# Altium project team throttle control draft 2.PrjPcb
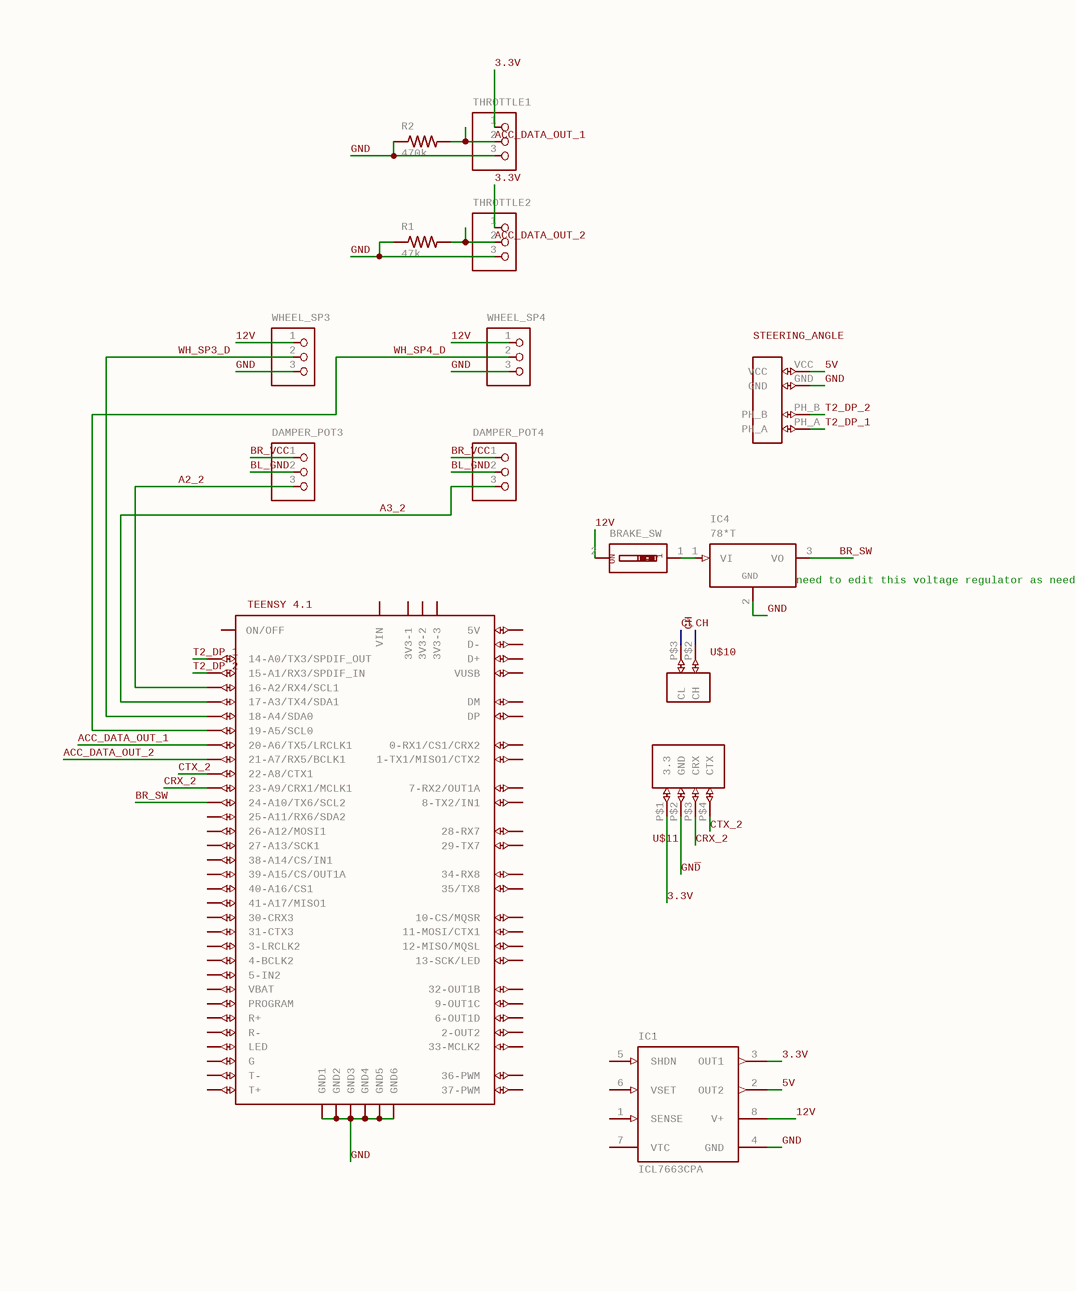
[diagram p0: team throttle control draft 2.SchDoc]
1 sheet, 15 parts. Net scope: global (net labels, ports and power ports of the same name join across sheets).
Board file: team throttle control draft 2.PcbDoc

## Sheet team throttle control draft 2.SchDoc
size 160 x 226 mm; Origin: Eagle

### Parts
BRAKE_SW  SW_DIP-1  [EDG-01]  (value not drawn)
DAMPER_POT3  PINHD-1X3CB  [1X03-CLEANBIG]  (value not drawn)
DAMPER_POT4  PINHD-1X3CB  [1X03-CLEANBIG]  (value not drawn)
IC1  ICL7663CPA  [DIL08]
IC4  78*T  [TO220H]
R1  47k  [0204/7]
R2  470k  [0204/7]
STEERING_ANGLE  ROTARY_ENCODER  [ROTARY_ENCODER]  (value not drawn)
THROTTLE1  PINHD-1X3  [1X03]  (value not drawn)
THROTTLE2  PINHD-1X3  [1X03]  (value not drawn)
U$3  TEENSY4.1: TEENSY 4.1  [TEENSY41]  (hidden comment: TEENSY41)
U$10  CAN_BUS  [CAN_BUS]  (value not drawn)
U$11  CAN_TEE  [CAN_TEN]  (value not drawn)
WHEEL_SP3  PINHD-1X3  [1X03]  (value not drawn)
WHEEL_SP4  PINHD-1X3  [1X03]  (value not drawn)

### Nets
3.3V: IC1.3(OUT1) THROTTLE1.1 THROTTLE2.1 U$11.P$1(3.3)
5V: IC1.2(OUT2) STEERING_ANGLE.VCC
12V: BRAKE_SW.2 IC1.8(V+) WHEEL_SP3.1 WHEEL_SP4.1
A2_2: DAMPER_POT3.3 U$3.16-A2/RX4/SCL1
A3_2: DAMPER_POT4.3 U$3.17-A3/TX4/SDA1
ACC_DATA_OUT_1: R2.2 THROTTLE1.2 U$3.20-A6/TX5/LRCLK1
ACC_DATA_OUT_2: R1.2 THROTTLE2.2 U$3.21-A7/RX5/BCLK1
BL_GND: DAMPER_POT3.2 DAMPER_POT4.2
BR_SW: IC4.3(VO) U$3.24-A10/TX6/SCL2
BR_VCC: DAMPER_POT3.1 DAMPER_POT4.1
CRX_2: U$3.23-A9/CRX1/MCLK1 U$11.P$3(CRX)
CTX_2: U$3.22-A8/CTX1 U$11.P$4(CTX)
GND: IC1.4(GND) IC4.2(GND) R1.1 R2.1 STEERING_ANGLE.GND THROTTLE1.3 THROTTLE2.3 U$3.GND1 U$3.GND2 U$3.GND3 U$3.GND4 U$3.GND5 U$3.GND6 WHEEL_SP3.3 WHEEL_SP4.3
GN~{D}: U$11.P$2(GND)
T2_DP_1: STEERING_ANGLE.PH_A U$3.14-A0/TX3/SPDIF_OUT
T2_DP_2: STEERING_ANGLE.PH_B U$3.15-A1/RX3/SPDIF_IN
WH_SP3_D: U$3.18-A4/SDA0 WHEEL_SP3.2
WH_SP4_D: U$3.19-A5/SCL0 WHEEL_SP4.2
NetBRAKE_SW_1: BRAKE_SW.1 IC4.1(VI)

Not connected (* = marked no-connect by the designer): IC1 1(SENSE) 5(SHDN) 6(VSET) 7(VTC); U$3 0-RX1/CS1/CRX2 1-TX1/MISO1/CTX2 2-OUT2 3-LRCLK2 3V3-1 3V3-2 3V3-3 4-BCLK2 5-IN2 6-OUT1D 7-RX2/OUT1A 8-TX2/IN2(8-TX2/IN1) 9-OUT1C 10-CS\MQSR(10-CS/MQSR) 11-MOSI/CTX1 12-MISO/MQSL 13-SCK/LED 25-A11/RX6/SDA2 26-A12/MOSI1 27-A13/SCK1 28-RX7 29-TX7 30-CRX3 31-CTX3 32-OUT1B 33-MCLK2 34-RX8 35-TX8(35/TX8) 36-PWM 37-PWM 38-A14/CS/IN1 39-A15/CS/OUT1A 40-A16/CS1 41-A17/MISO1 +5V(5V) D+ D- DM DP G LED ON/OFF PROGRAM R+ R- T+ T- VBAT VIN VUSB; U$10 P$2(CH) P$3(CL)

### Buses and harness runs
bus CH
bus CL

### Notes on the sheet
- (near IC4) need to edit this voltage regulator as needed

### Library data of the parts
BRAKE_SW = SW_DIP-1: DIP SWITCH; GateName_1: G$1; POPULARITY: 3; SymbolName_1: SW_DIP-1; LibraryName: special; DeviceSetName: SW_DIP-1; 1: 1; ON: ON
DAMPER_POT3 DAMPER_POT4 = PINHD-1X3CB: PIN HEADER; GateName_1: A; SymbolName_1: PINHD3; DeviceName: CB; LibraryName: adafruit; DeviceSetName: PINHD-1X3
IC1 = ICL7663CPA: Positive VOLTAGE REGULATOR; GateName_1: G$1; POPULARITY: 0; SymbolName_1: ICL7663; LibraryName: maxim; DeviceSetName: ICL7663CPA; MF: MF; MPN: MPN; OC_FARNELL: unknown; OC_NEWARK: unknown
IC4 = 78*T: Positive VOLTAGE REGULATOR   Added bigger pads to the TO-92 package; GateName_1: A1; SymbolName_1: 78XX; DeviceName: T; DeviceSetName: 78*; LibraryName: adafruit; GND: GND
R1 R2 = R-US_0204/7: RESISTOR, American symbol; GateName_1: G$1; SymbolName_1: R-US; DeviceSetName: R-US_; POPULARITY: 48; DeviceName: 0204/7; LibraryName: rcl; SPICEPREFIX: R
STEERING_ANGLE = ROTARY_ENCODER: GateName_1: G$1; SymbolName_1: ROTARY_ENCODER; LibraryName: F-E library custom components; DeviceSetName: ROTARY_ENCODER
THROTTLE1 THROTTLE2 WHEEL_SP3 WHEEL_SP4 = PINHD-1X3: PIN HEADER; GateName_1: A; SymbolName_1: PINHD3; LibraryName: adafruit; DeviceSetName: PINHD-1X3
U$3 = TEENSY41: GateName_1: G$1; SymbolName_1: TEENSY41; LibraryName: teensy; DeviceSetName: TEENSY41
U$10 = CAN_BUS: GateName_1: G$1; SymbolName_1: CAN_BUS; LibraryName: F-E library custom components; DeviceSetName: CAN_BUS
U$11 = CAN_TEE: GateName_1: G$1; SymbolName_1: CAN_TEN; LibraryName: F-E library custom components; DeviceSetName: CAN_TEE